# Altium schematic sheet ECU_AutoRC_ACC_SERVO_r00.SchDoc
size A4; SheetNumber: 4; SheetTotal: 9
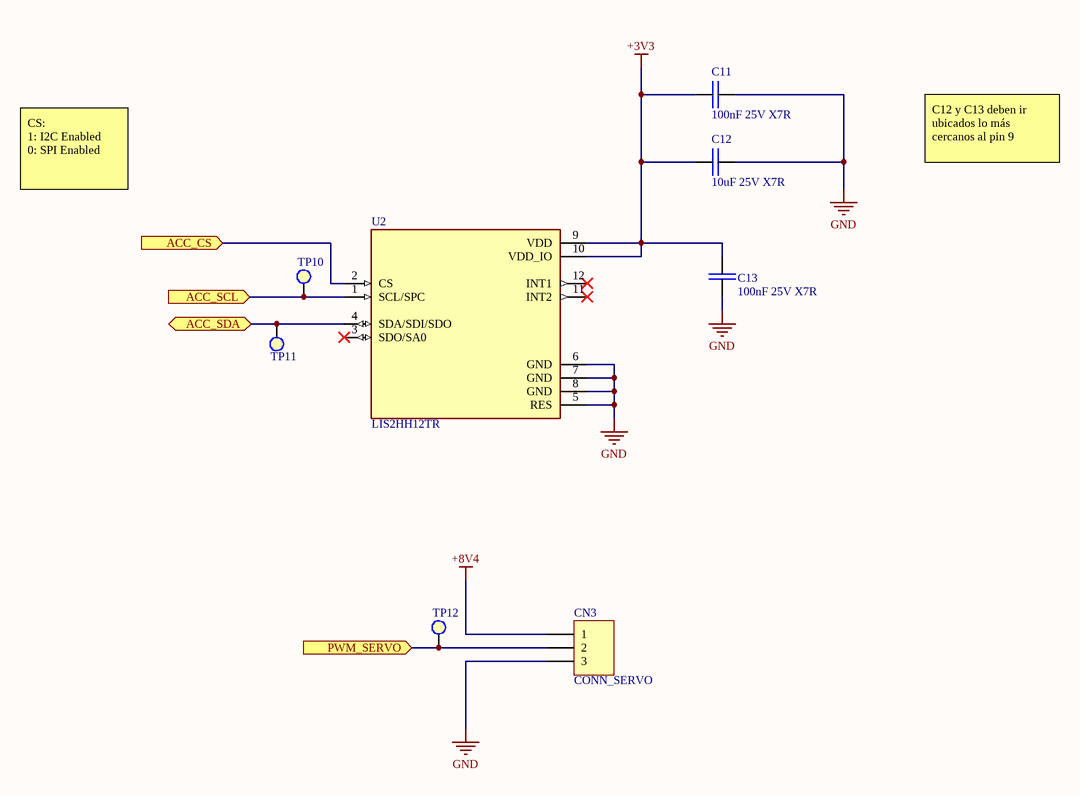
[diagram p0: ECU_AutoRC_ACC_SERVO_r00.SchDoc]

## Parts
C11  100nF 25V X7R  [C_0805]
C12  10uF 25V X7R  [C_1206]
C13  100nF 25V X7R  [C_0805]
CN3  CONN_SERVO  [HEADER_M_1X3_2.5MM]
TP10  Test Point  [TEST_POINT]  (value not drawn)
TP11  Test Point  [TEST_POINT]  (value not drawn)
TP12  Test Point  [TEST_POINT]  (value not drawn)
U2  LIS2HH12TR  [PQFN50P200X200X100-12N]

## Ports
ACC_CS (in, see ECU_AutoRC_BLK_r00[4A], ECU_AutoRC_UC1_r00[3B]), ACC_SCL (in, see ECU_AutoRC_BLK_r00[4A], ECU_AutoRC_UC1_r00[3B]), ACC_SDA (bidir, see ECU_AutoRC_BLK_r00[4A], ECU_AutoRC_UC1_r00[3B]), PWM_SERVO (in, see ECU_AutoRC_BLK_r00[4A], ECU_AutoRC_UC1_r00[1C])

## Nets
+3V3: C11.1 C12.1 C13.1 U2.9(VDD) U2.10(VDD_IO)
+8V4: CN3.1
GND: C11.2 C12.2 C13.2 CN3.3 U2.5(RES) U2.6(GND) U2.7(GND) U2.8(GND)
ACC_CS: U2.2(CS) ; port ACC_CS
ACC_SCL: TP10.1 U2.1(SCL/SPC) ; port ACC_SCL
ACC_SDA: TP11.1 U2.4(SDA/SDI/SDO) ; port ACC_SDA
PWM_SERVO: CN3.2 TP12.1 ; port PWM_SERVO

Not connected (* = marked no-connect by the designer): U2 3(SDO/SA0)* 11(INT2)* 12(INT1)*

## Notes on the sheet
- CS:
  1: I2C Enabled
  0: SPI Enabled
- C12 y C13 deben ir ubicados lo más cercanos al pin 9

## Library data of the parts
C11-C13 = Capacitor NP: Non Polarizated Capacitor
CN3 = CONN_03P: 3 Pin Connector
TP10-TP12 = TestPoint
U2 = LIS2HH12TR: Accelerometer X, Y, Z Axis Â±2g, 4g, 8g 5Hz ~ 400Hz 12-LGA _2x2_; MF: STMicroelectronics; Value: *; MP: LIS2HH12TR; SnapEDA_Link: https://www.snapeda.com/parts/LIS2HH12TR/STMicroelectronics/view-part/552242/?ref=snap; Availability: Unavailable; Package: LGA-12 STMicroelectronics; Price: None